# EAGLE schematic mePed (EAGLE 7.6.0)
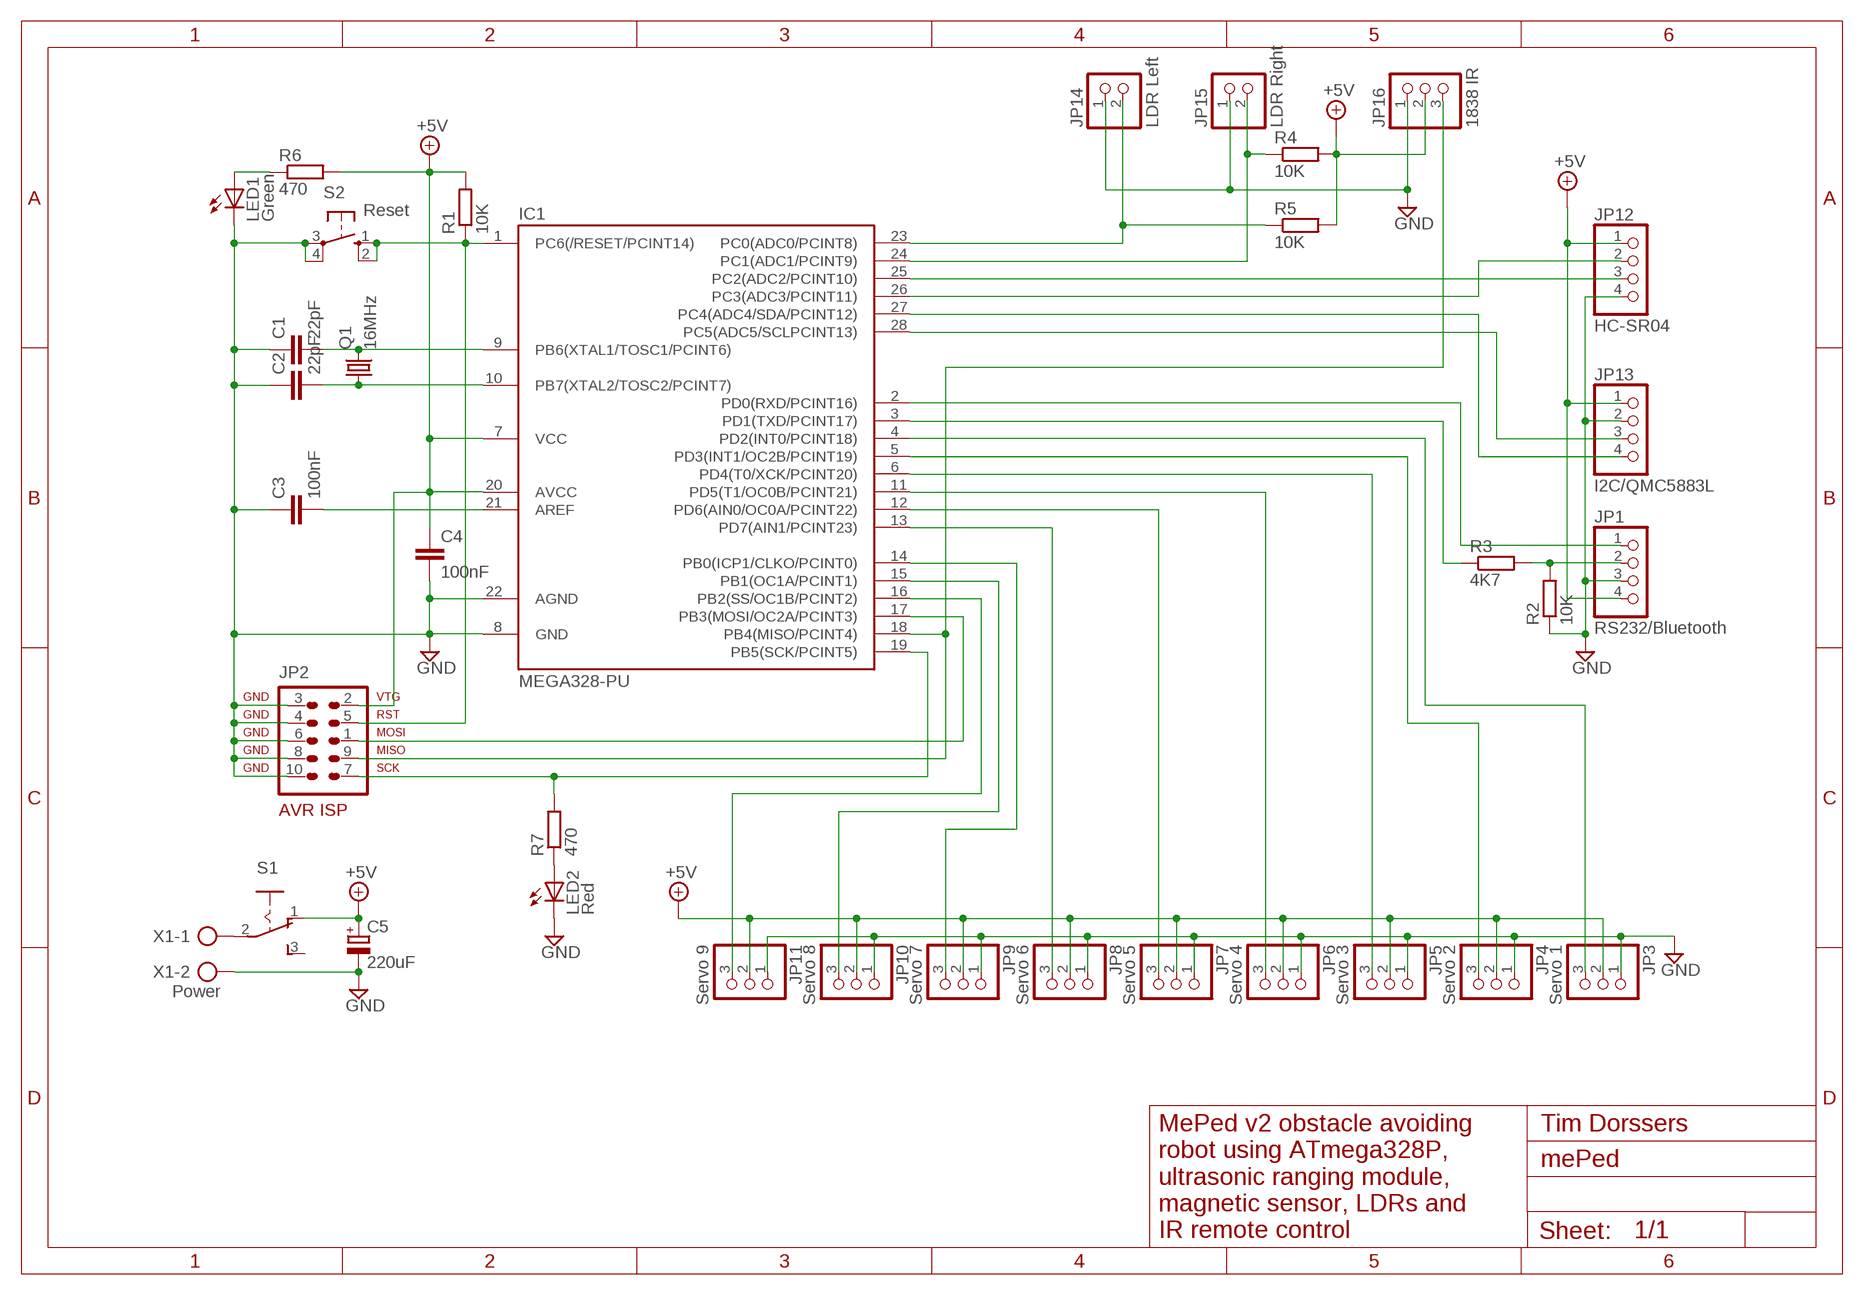
[diagram p0: schematic, sheet 1]

## Parts
C1  22pF  C-EU025-024X044  [C025-024X044]
C2  22pF  C-EU025-024X044  [C025-024X044]
C3  100nF  C-EU025-025X050  [C025-025X050]
C4  100nF  C-EU025-025X050  [C025-025X050]
C5  220uF  CPOL-EUB45181A  [B45181A]
IC1  MEGA328-PU  MEGA48/88/168-PU  [DIL28-3]
JP1  RS232/Bluetooth  PINHD-1X4  [1X04]
JP2  AVR-ISP-10  [AVR-ISP-10]
JP3  Servo 1  PINHD-1X3  [1X03]
JP4  Servo 2  PINHD-1X3  [1X03]
JP5  Servo 3  PINHD-1X3  [1X03]
JP6  Servo 4  PINHD-1X3  [1X03]
JP7  Servo 5  PINHD-1X3  [1X03]
JP8  Servo 6  PINHD-1X3  [1X03]
JP9  Servo 7  PINHD-1X3  [1X03]
JP10  Servo 8  PINHD-1X3  [1X03]
JP11  Servo 9  PINHD-1X3  [1X03]
JP12  HC-SR04  PINHD-1X4  [1X04]
JP13  I2C/QMC5883L  PINHD-1X4  [1X04]
JP14  LDR Left  PINHD-1X2  [1X02]
JP15  LDR Right  PINHD-1X2  [1X02]
JP16  1838 IR  PINHD-1X3  [1X03]
LED1  Green  LED5MM  [LED5MM]
LED2  Red  LED5MM  [LED5MM]
Q1  16MHz  CRYSTALHC49S  [HC49/S]
R1  10K  R-EU_0204/7  [0204/7]
R2  10K  R-EU_0204/7  [0204/7]
R3  4K7  R-EU_0204/7  [0204/7]
R4  10K  R-EU_0204/7  [0204/7]
R5  10K  R-EU_0204/7  [0204/7]
R6  470  R-EU_0204/7  [0204/7]
R7  470  R-EU_0204/7  [0204/7]
S1  255SB  [255SB]
S2  Reset  10-XX  [B3F-10XX]
X1  Power  AK300/2  [AK300/2]

## Nets
+5V: C4.1 C5.+ IC1.7(VCC) IC1.20(AVCC) JP1.4 JP2.2 JP3.2 JP4.2 JP5.2 JP6.2 JP7.2 JP8.2 JP9.2 JP10.2 JP11.2 JP12.1 JP13.1 JP16.2 R1.2 R4.2 R5.2 R6.2 S1.1(O)
GND: C1.1 C2.1 C3.1 C4.2 C5.- IC1.8(GND) IC1.22(AGND) JP1.3 JP2.3 JP2.4 JP2.6 JP2.8 JP2.10 JP3.1 JP4.1 JP5.1 JP6.1 JP7.1 JP8.1 JP9.1 JP10.1 JP11.1 JP12.4 JP13.2 JP14.1 JP15.1 JP16.1 LED1.K(C) LED2.K(C) R2.1 S2.3(P) S2.4(P1) X1.2
N$1: IC1.23(PC0(ADC0/PCINT8)) JP14.2 R5.1
N$2: IC1.1(PC6(/RESET/PCINT14)) JP2.5 R1.1 S2.1(S) S2.2(S1)
N$3: IC1.24(PC1(ADC1/PCINT9)) JP15.2 R4.1
N$4: IC1.25(PC2(ADC2/PCINT10)) JP12.3
N$5: IC1.26(PC3(ADC3/PCINT11)) JP12.2
N$6: IC1.27(PC4(ADC4/SDA/PCINT12)) JP13.4
N$7: IC1.28(PC5(ADC5/SCLPCINT13)) JP13.3
N$8: IC1.2(PD0(RXD/PCINT16)) JP1.1
N$9: IC1.3(PD1(TXD/PCINT17)) R3.1
N$10: IC1.5(PD3(INT1/OC2B/PCINT19)) JP4.3
N$11: IC1.6(PD4(T0/XCK/PCINT20)) JP5.3
N$12: IC1.4(PD2(INT0/PCINT18)) JP3.3
N$13: IC1.11(PD5(T1/OC0B/PCINT21)) JP6.3
N$14: IC1.19(PB5(SCK/PCINT5)) JP2.7 R7.2
N$15: IC1.18(PB4(MISO/PCINT4)) JP2.9 JP16.3
N$16: IC1.17(PB3(MOSI/OC2A/PCINT3)) JP2.1
N$17: IC1.12(PD6(AIN0/OC0A/PCINT22)) JP7.3
N$18: IC1.13(PD7(AIN1/PCINT23)) JP8.3
N$19: IC1.16(PB2(SS/OC1B/PCINT2)) JP11.3
N$20: C1.2 IC1.9(PB6(XTAL1/TOSC1/PCINT6)) Q1.2
N$21: C2.2 IC1.10(PB7(XTAL2/TOSC2/PCINT7)) Q1.1
N$22: IC1.15(PB1(OC1A/PCINT1)) JP10.3
N$23: JP1.2 R2.2 R3.2
N$24: C3.2 IC1.21(AREF)
N$25: IC1.14(PB0(ICP1/CLKO/PCINT0)) JP9.3
N$26: S1.2(P) X1.1
N$28: LED1.A R6.1
N$29: LED2.A R7.1
Unconnected: S1.3(S)

## Notes on the sheet
- Tim Dorssers
- MePed v2 obstacle avoiding
  robot using ATmega328P,
  ultrasonic ranging module,
  magnetic sensor, LDRs and
  IR remote control

## Library data of the parts
C1-C4 = rcl:C-EU: CAPACITOR, European symbol
C5 = resistor:CPOL-EU: POLARIZED CAPACITOR, European symbol
IC1 = avr-7:MEGA48/88/168-PU
JP1 JP12 JP13 = pinhead:PINHD-1X4: PIN HEADER
JP2 = avr-7:AVR-ISP-10: AVR ISP-10 Serial Programming Header
JP3-JP11 JP16 = pinhead:PINHD-1X3: PIN HEADER
JP14 JP15 = pinhead:PINHD-1X2: PIN HEADER
LED1 LED2 = led:LED: LED OSRAM: - CHIPLED LG R971, LG N971, LY N971, LG Q971, LY Q971, LO R971, LY R971 LH N974, LH R974 LS Q976, LO Q976, LY Q976 LO Q996 - Hyper CHIPLED LW Q18S LB Q993, LB Q99A, LB R99A - SideLED LS A670, LO A670, LY A670, LG A670, LP A670 LB A673, LV A673, LT A673, LW A673 LH A674 LY A675 LS A676, LA A676, LO A676, LY A676, LW A676 LS A679, LY A679, LG A679 - Hyper Micro SIDELED® LS Y876, LA Y876, LO Y876, LY Y876 LT Y87S - SmartLED LW L88C, LW L88S LB L89C, LB L89S, LG L890 LS L89K, LO L89K, LY L89K LS L896, LA L896, LO L896, LY L896 - TOPLED LS T670, LO T670, LY T670, LG T670, LP T670 LSG T670, LSP T670, LSY T670, LOP T670, LYG T670 LG T671, LOG T671, LSG T671 LB T673, LV T673, LT T673, LW T673 LH T674 LS T676, LA T676, LO T676, LY T676, LB T676, LH T676, LSB T676, LW T676 LB T67C, LV T67C, LT T67C, LS T67K, LO T67K, LY T67K, LW E67C LS E67B, LA E67B, LO E67B, LY E67B, LB E67C, LV E67C, LT E67C LW T67C LS T679, LY T679, LG T679 LS T770, LO T770, LY T770, LG T770, LP T770 LB T773, LV T773, LT T773, LW T773 LH T774 LS E675, LA E675, LY E675, LS T675 LS T776, LA T776, LO T776, LY T776, LB T776 LHGB T686 LT T68C, LB T68C - Hyper Mini TOPLED® LB M676 - Mini TOPLED Santana® LG M470 LS M47K, LO M47K, LY M47K Source: http://www.osram.convergy.de LUXEON: - LUMILED® LXK2-PW12-R00, LXK2-PW12-S00, LXK2-PW14-U00, LXK2-PW14-V00 LXK2-PM12-R00, LXK2-PM12-S00, LXK2-PM14-U00 LXK2-PE12-Q00, LXK2-PE12-R00, LXK2-PE12-S00, LXK2-PE14-T00, LXK2-PE14-U00 LXK2-PB12-K00, LXK2-PB12-L00, LXK2-PB12-M00, LXK2-PB14-N00, LXK2-PB14-P00, LXK2-PB14-Q00 LXK2-PR12-L00, LXK2-PR12-M00, LXK2-PR14-Q00, LXK2-PR14-R00 LXK2-PD12-Q00, LXK2-PD12-R00, LXK2-PD12-S00 LXK2-PH12-R00, LXK2-PH12-S00 LXK2-PL12-P00, LXK2-PL12-Q00, LXK2-PL12-R00 Source: www.luxeon.com KINGBRIGHT: KA-3528ASYC Source: www.kingbright.com
Q1 = crystal:CRYSTAL: CRYSTAL; OC_FARNELL: 1667008; OC_NEWARK: unknown
R1-R3 = rcl:R-EU_: RESISTOR, European symbol
R4-R7 = resistor:R-EU_: RESISTOR, European symbol
S1 = switch:255SB: SLIDING SWITCH Distributor Buerklin, 11G810
S2 = switch-omron:10-XX: OMRON SWITCH; MPN: B3F-1000; OC_FARNELL: 176432; OC_NEWARK: 36M3542
X1 = con-ptr500:AK300/2: CONNECTOR; OC_FARNELL: unknown; OC_NEWARK: unknown